# Altium schematic sheet SH7 - SD CARD CONNECTOR.SchDoc: SD Card
size Letter; DrawnBy: Ayesha Ebrahim; SheetNumber: 6; SheetTotal: 6
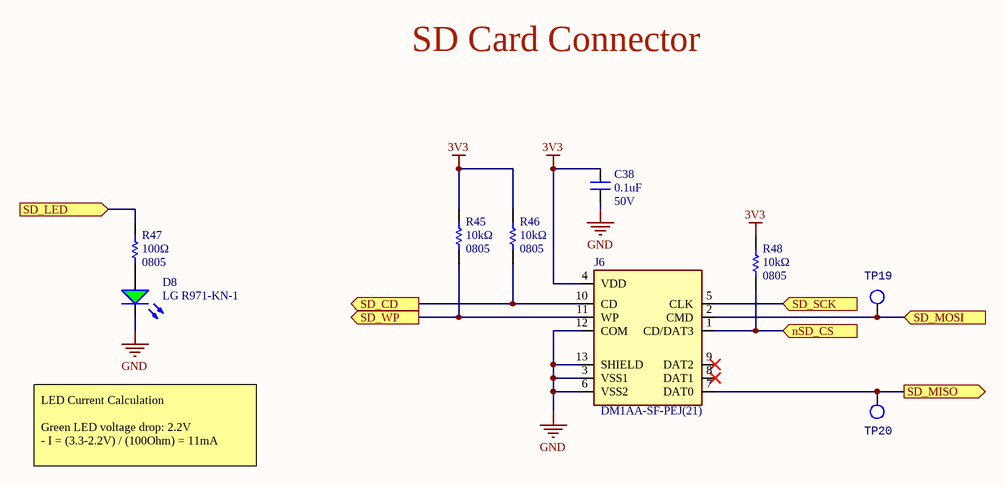
[diagram p0: SH7 - SD CARD CONNECTOR.SchDoc]

## Parts
C38  value 0.1uF  Voltage Rating: 50V  [CAPC2012X140N]  (hidden comment: CAP_0.1uF_50V_0805)
D8  Manufacturer Part Number 1: LG R971-KN-1  [LED_0805_LINE]  (hidden comment: DIO_LED_G)
J6  Manufacturer Part Number 1: DM1AA-SF-PEJ(21)  [HRS_DM1AA-SF-PEJ(21)]  (hidden comment: SD_CARD_CON)
R45  value 10kΩ  Case Code (Imperial): 0805  [RESC2012X60N]  (hidden comment: RES_10kΩ_0805)
R46  value 10kΩ  Case Code (Imperial): 0805  [RESC2012X60N]  (hidden comment: RES_10kΩ_0805)
R47  value 100Ω  Case Code (Imperial): 0805  [RESC2012X60N]  (hidden comment: RES_100Ω_0805)
R48  value 10kΩ  Case Code (Imperial): 0805  [RESC2012X60N]  (hidden comment: RES_10kΩ_0805)
TP19  TESTPOINT_LOOP  [TESTPOINT_LOOP]  (value not drawn)
TP20  TESTPOINT_LOOP  [TESTPOINT_LOOP]  (value not drawn)

## Ports
nSD_CS (in), SD_CD (out), SD_LED (in), SD_MISO (out), SD_MOSI (in), SD_SCK (in), SD_WP (out)

## Nets
3V3: C38.2 J6.4(VDD) R45.2 R46.2 R48.2
GND: C38.1 D8.2(K) J6.3(VSS1) J6.6(VSS2) J6.12(COM) J6.13(SHIELD)
nSD_CS: J6.1(CD/DAT3) R48.1 ; port nSD_CS
SD_CD: J6.10(CD) R46.1 ; port SD_CD
SD_LED: R47.2 ; port SD_LED
SD_MISO: J6.7(DAT0) TP20.1 ; port SD_MISO
SD_MOSI: J6.2(CMD) TP19.1 ; port SD_MOSI
SD_SCK: J6.5(CLK) ; port SD_SCK
SD_WP: J6.11(WP) R45.1 ; port SD_WP
NetD8_1: D8.1(A) R47.1

Not connected (* = marked no-connect by the designer): J6 8(DAT1)* 9(DAT2)*

## Notes on the sheet
- SD Card Connector
- LED Current Calculation
  Green LED voltage drop: 2.2V
  - I = (3.3-2.2V) / (100Ohm) = 11mA
- Title
- Size:
- Date:
- Letter
- Drawn By:
- Sheet
- of
- File:

## Library data of the parts
C38 = CAP_0.1uF_50V_0805: CAP CER 0.1UF 50V X7R 0805; Manufacturer 1: Murata Electronics; Manufacturer Part Number 1: GCD21BR71H104KA01L; Capacitance: 100nF; Tolerance: 10%; Mount: Surface Mount; Case/Package: 0805; Case Code (Metric): 2012; Case Code (Imperial): 0805; Min Operating Temperature: -55°C; Max Operating Temperature: 125°C; Dielectric: X7R; Termination: SMD/SMT; Length: 2mm; Height: 1.25mm; Width: 0.049inch; Thickness: 0.049inch; Depth: 1.25mm; Ratings: AEC-Q200; ComponentLink1URL: https://datasheet.ciiva.com/29537/c03e-29537701.pdf?src-supplier=Digi-Key; ComponentLink1Description: https://datasheet.ciiva.com/29537/c03e-29537701.pdf?src-supplier=Digi-Key; Supplier 1: Digi-Key; Supplier Part Number 1: 490-11955-1-ND
D8 = DIO_LED_G: LED GREEN DIFFUSED 0805 SMD; Manufacturer 1: OSRAM; Forward Voltage Drop: 2.2V; Package: 0805 (2012 Metric); Supplier Part Number 1: 475-1410-1-ND; Supplier 1: Digi-Key; Mount: Surface Mount
J6 = SD_CARD_CON: 12 _9 + 3_ Position Card Connector Secure Digital - SD Surface Mount, Right Angle Gold; Manufacturer 1: Hirose Electric Co Ltd; Supplier 1: Digi-Key; Supplier Part Number 1: HR845CT-ND; Mount: Surface Mount; Card Type: SD
R45 R46 R48 = RES_10kΩ_0805: RES SMD 10K OHM 1% 1/8W 0805; Manufacturer 1: Yageo; Manufacturer Part Number 1: RC0805FR-0710KL; Power Rating: 125mW; Supplier 1: Digi-Key; Case Code (Metric): 2012; Min Operating Temperature: -55°C; Max Operating Temperature: 155°C; Resistance: 10K; Tolerance: 1%; Termination: SMD/SMT; Supplier Part Number 1: 311-10.0KCRCT-ND
R47 = RES_100Ω_0805: RES SMD 100 OHM 1% 1/8W 0805; Manufacturer 1: Yageo; Manufacturer Part Number 1: RC0805FR-07100RL; Power Rating: 125mW; Supplier 1: Digi-Key; Mount: Surface Mount; Case Code (Metric): 2012; Supplier Part Number 1: 311-100CRCT-ND
TP19 TP20 = TESTPOINT_LOOP: Loop testpoint through-hole pad; Manufacturer Part Number 1: 5002; Manufacturer 1: Keystone Electronics; Supplier Part Number 1: 36-5002-ND; Supplier 1: Digi-Key; Mount: Through Hole